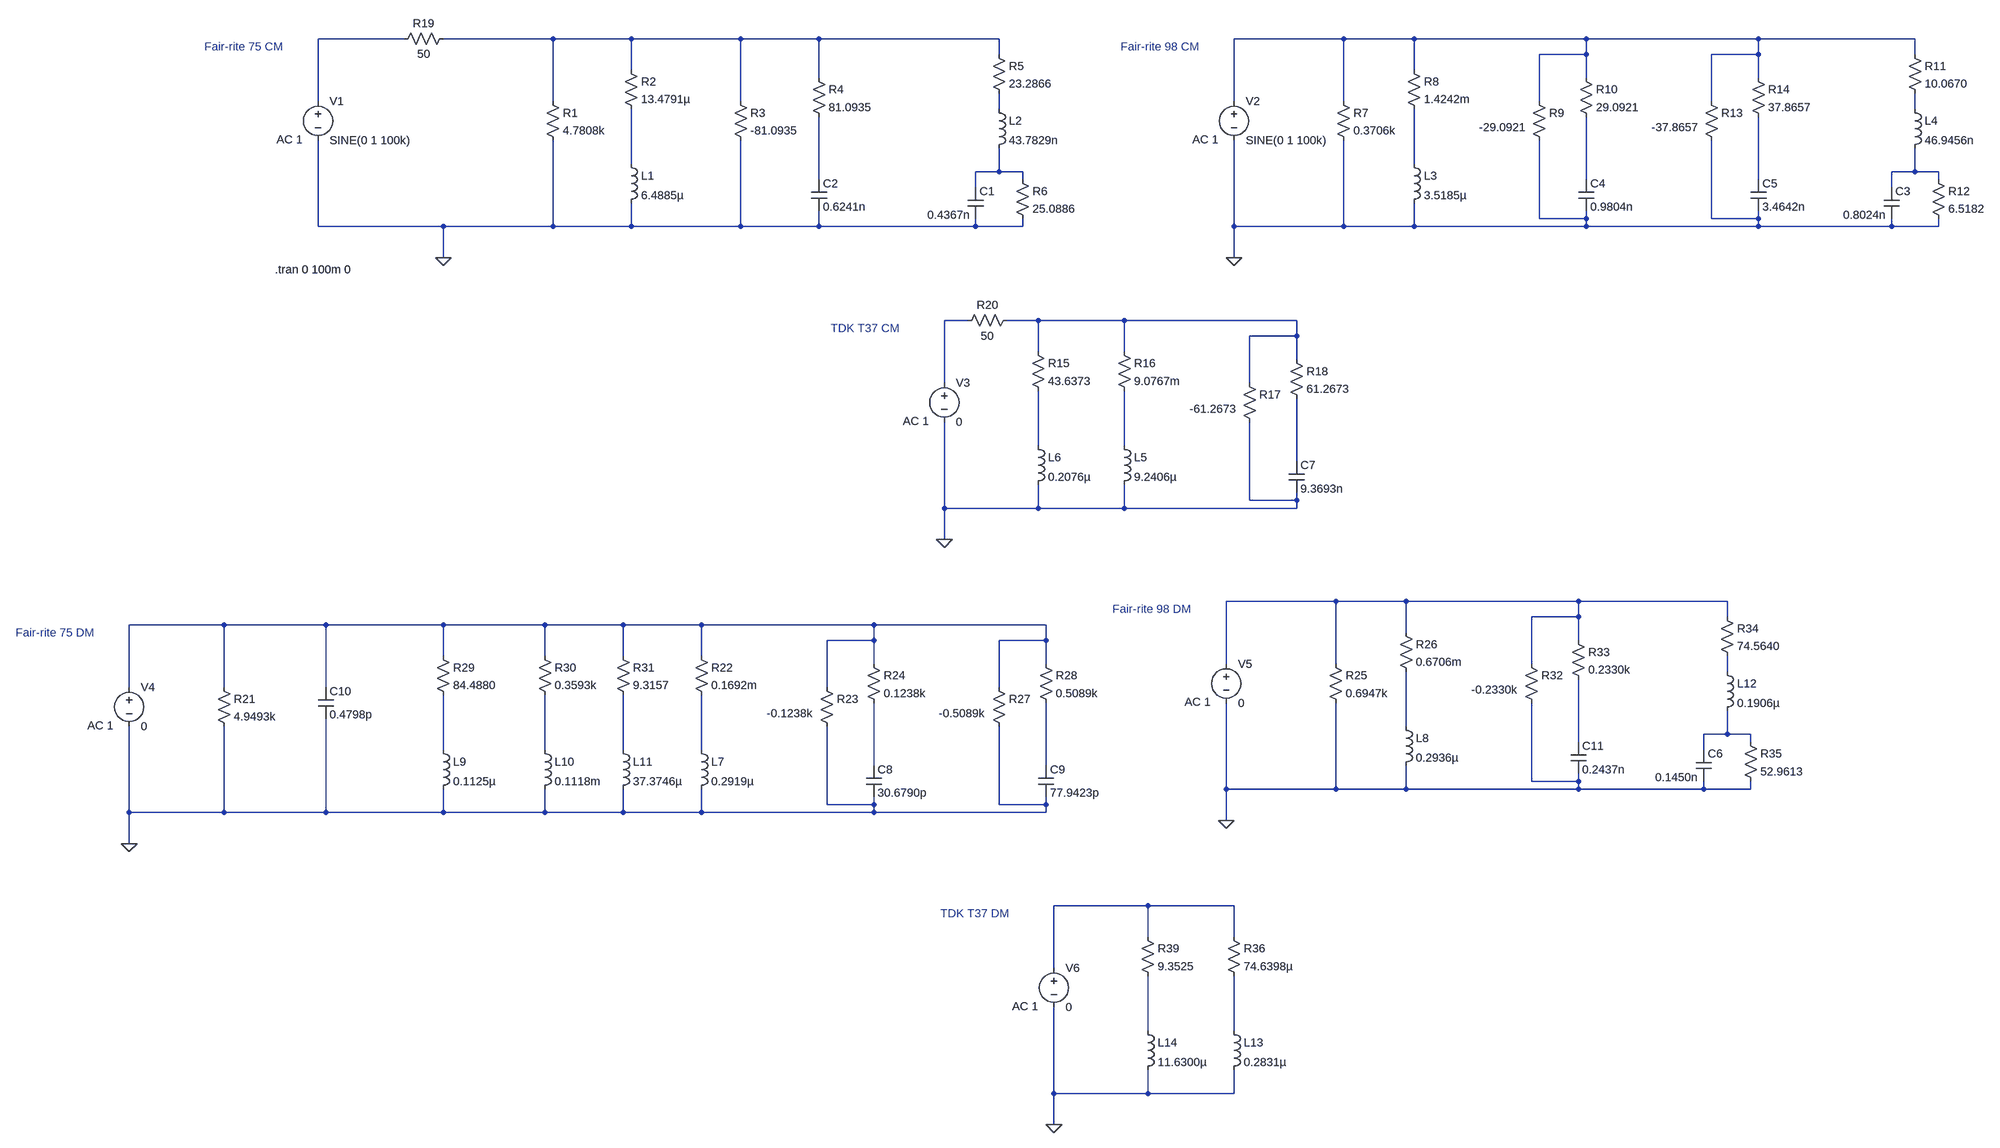
[diagram p0: schematic EC.asc]
EC.asc, the LTspice schematic file:
Version 4
SHEET 1 3976 868
WIRE -1728 -1376 -1904 -1376
WIRE -1424 -1376 -1648 -1376
WIRE -1264 -1376 -1424 -1376
WIRE -1040 -1376 -1264 -1376
WIRE -880 -1376 -1040 -1376
WIRE -512 -1376 -880 -1376
WIRE 192 -1376 -32 -1376
WIRE 336 -1376 192 -1376
WIRE 688 -1376 336 -1376
WIRE 1040 -1376 688 -1376
WIRE 1360 -1376 1040 -1376
WIRE -512 -1344 -512 -1376
WIRE 688 -1344 688 -1376
WIRE 688 -1344 592 -1344
WIRE 1040 -1344 1040 -1376
WIRE 1040 -1344 944 -1344
WIRE 1360 -1344 1360 -1376
WIRE -1264 -1312 -1264 -1376
WIRE 336 -1312 336 -1376
WIRE -880 -1296 -880 -1376
WIRE 688 -1296 688 -1344
WIRE 1040 -1296 1040 -1344
WIRE -1904 -1248 -1904 -1376
WIRE -1424 -1248 -1424 -1376
WIRE -1040 -1248 -1040 -1376
WIRE -32 -1248 -32 -1376
WIRE 192 -1248 192 -1376
WIRE 592 -1248 592 -1344
WIRE 944 -1248 944 -1344
WIRE -512 -1232 -512 -1264
WIRE 1360 -1232 1360 -1264
WIRE -1264 -1120 -1264 -1232
WIRE 336 -1120 336 -1232
WIRE -512 -1104 -512 -1152
WIRE -512 -1104 -560 -1104
WIRE -464 -1104 -512 -1104
WIRE 1360 -1104 1360 -1152
WIRE 1360 -1104 1312 -1104
WIRE 1408 -1104 1360 -1104
WIRE -880 -1088 -880 -1216
WIRE -464 -1088 -464 -1104
WIRE 688 -1088 688 -1216
WIRE 1040 -1088 1040 -1216
WIRE 1408 -1088 1408 -1104
WIRE -560 -1072 -560 -1104
WIRE 1312 -1072 1312 -1104
WIRE 592 -1008 592 -1168
WIRE 688 -1008 688 -1024
WIRE 688 -1008 592 -1008
WIRE 944 -1008 944 -1168
WIRE 1040 -1008 1040 -1024
WIRE 1040 -1008 944 -1008
WIRE -1904 -992 -1904 -1168
WIRE -1648 -992 -1904 -992
WIRE -1424 -992 -1424 -1168
WIRE -1424 -992 -1648 -992
WIRE -1264 -992 -1264 -1040
WIRE -1264 -992 -1424 -992
WIRE -1040 -992 -1040 -1168
WIRE -1040 -992 -1264 -992
WIRE -880 -992 -880 -1024
WIRE -880 -992 -1040 -992
WIRE -560 -992 -560 -1008
WIRE -560 -992 -880 -992
WIRE -464 -992 -464 -1008
WIRE -464 -992 -560 -992
WIRE -32 -992 -32 -1168
WIRE 192 -992 192 -1168
WIRE 192 -992 -32 -992
WIRE 336 -992 336 -1040
WIRE 336 -992 192 -992
WIRE 688 -992 688 -1008
WIRE 688 -992 336 -992
WIRE 1040 -992 1040 -1008
WIRE 1040 -992 688 -992
WIRE 1312 -992 1312 -1008
WIRE 1312 -992 1040 -992
WIRE 1408 -992 1408 -1008
WIRE 1408 -992 1312 -992
WIRE -1648 -928 -1648 -992
WIRE -32 -928 -32 -992
WIRE -576 -800 -624 -800
WIRE -432 -800 -496 -800
WIRE -256 -800 -432 -800
WIRE 96 -800 -256 -800
WIRE 96 -768 96 -800
WIRE 96 -768 0 -768
WIRE -432 -736 -432 -800
WIRE -256 -736 -256 -800
WIRE 96 -720 96 -768
WIRE -624 -672 -624 -800
WIRE 0 -672 0 -768
WIRE -432 -544 -432 -656
WIRE -256 -544 -256 -656
WIRE 96 -512 96 -640
WIRE 0 -432 0 -592
WIRE 96 -432 96 -448
WIRE 96 -432 0 -432
WIRE -624 -416 -624 -592
WIRE -432 -416 -432 -464
WIRE -432 -416 -624 -416
WIRE -256 -416 -256 -464
WIRE -256 -416 -432 -416
WIRE 96 -416 96 -432
WIRE 96 -416 -256 -416
WIRE -624 -352 -624 -416
WIRE 176 -224 -48 -224
WIRE 320 -224 176 -224
WIRE 672 -224 320 -224
WIRE 976 -224 672 -224
WIRE 672 -192 672 -224
WIRE 672 -192 576 -192
WIRE 976 -192 976 -224
WIRE -2096 -176 -2320 -176
WIRE -1888 -176 -2096 -176
WIRE -1648 -176 -1888 -176
WIRE -1440 -176 -1648 -176
WIRE -1280 -176 -1440 -176
WIRE -1120 -176 -1280 -176
WIRE -768 -176 -1120 -176
WIRE -416 -176 -768 -176
WIRE 320 -160 320 -224
WIRE -768 -144 -768 -176
WIRE -768 -144 -864 -144
WIRE -416 -144 -416 -176
WIRE -416 -144 -512 -144
WIRE 672 -144 672 -192
WIRE -1648 -112 -1648 -176
WIRE -1440 -112 -1440 -176
WIRE -1280 -112 -1280 -176
WIRE -1120 -112 -1120 -176
WIRE -768 -96 -768 -144
WIRE -416 -96 -416 -144
WIRE -48 -96 -48 -224
WIRE 176 -96 176 -224
WIRE 576 -96 576 -192
WIRE 976 -80 976 -112
WIRE -2320 -48 -2320 -176
WIRE -2096 -48 -2096 -176
WIRE -1888 -48 -1888 -176
WIRE -864 -48 -864 -144
WIRE -512 -48 -512 -144
WIRE 320 32 320 -80
WIRE 976 48 976 0
WIRE 976 48 928 48
WIRE 1024 48 976 48
WIRE 672 64 672 -64
WIRE 1024 64 1024 48
WIRE -1648 80 -1648 -32
WIRE -1440 80 -1440 -32
WIRE -1280 80 -1280 -32
WIRE -1120 80 -1120 -32
WIRE 928 80 928 48
WIRE -768 112 -768 -16
WIRE -416 112 -416 -16
WIRE 576 144 576 -16
WIRE 672 144 672 128
WIRE 672 144 576 144
WIRE -48 160 -48 -16
WIRE 176 160 176 -16
WIRE 176 160 -48 160
WIRE 320 160 320 112
WIRE 320 160 176 160
WIRE 672 160 672 144
WIRE 672 160 320 160
WIRE 928 160 928 144
WIRE 928 160 672 160
WIRE 1024 160 1024 144
WIRE 1024 160 928 160
WIRE -864 192 -864 32
WIRE -768 192 -768 176
WIRE -768 192 -864 192
WIRE -512 192 -512 32
WIRE -416 192 -416 176
WIRE -416 192 -512 192
WIRE -2320 208 -2320 32
WIRE -2096 208 -2096 32
WIRE -2096 208 -2320 208
WIRE -1888 208 -1888 16
WIRE -1888 208 -2096 208
WIRE -1648 208 -1648 160
WIRE -1648 208 -1888 208
WIRE -1440 208 -1440 160
WIRE -1440 208 -1648 208
WIRE -1280 208 -1280 160
WIRE -1280 208 -1440 208
WIRE -1120 208 -1120 160
WIRE -1120 208 -1280 208
WIRE -768 208 -768 192
WIRE -768 208 -1120 208
WIRE -416 208 -416 192
WIRE -416 208 -768 208
WIRE -48 224 -48 160
WIRE -2320 272 -2320 208
WIRE -208 400 -400 400
WIRE -32 400 -208 400
WIRE -208 464 -208 400
WIRE -32 464 -32 400
WIRE -400 528 -400 400
WIRE -208 656 -208 544
WIRE -32 656 -32 544
WIRE -400 784 -400 608
WIRE -208 784 -208 736
WIRE -208 784 -400 784
WIRE -32 784 -32 736
WIRE -32 784 -208 784
WIRE -400 848 -400 784
FLAG -1648 -928 0
FLAG -32 -928 0
FLAG -624 -352 0
FLAG -2320 272 0
FLAG -48 224 0
FLAG -400 848 0
SYMBOL voltage -1904 -1264 R0
WINDOW 123 -85 94 Left 2
WINDOW 39 0 0 Left 0
SYMATTR Value2 AC 1
SYMATTR InstName V1
SYMATTR Value SINE(0 1 100k)
SYMBOL res -1440 -1264 R0
SYMATTR InstName R1
SYMATTR Value 4.7808k
SYMBOL res -1280 -1328 R0
SYMATTR InstName R2
SYMATTR Value 13.4791µ
SYMBOL res -1056 -1264 R0
SYMATTR InstName R3
SYMATTR Value -81.0935
SYMBOL res -896 -1312 R0
SYMATTR InstName R4
SYMATTR Value 81.0935
SYMBOL res -528 -1360 R0
SYMATTR InstName R5
SYMATTR Value 23.2866
SYMBOL res -480 -1104 R0
SYMATTR InstName R6
SYMATTR Value 25.0886
SYMBOL cap -576 -1072 R0
WINDOW 3 -83 56 Left 2
SYMATTR Value 0.4367n
SYMATTR InstName C1
SYMBOL cap -896 -1088 R0
SYMATTR InstName C2
SYMATTR Value 0.6241n
SYMBOL ind -1280 -1136 R0
SYMATTR InstName L1
SYMATTR Value 6.4885µ
SYMBOL ind -528 -1248 R0
SYMATTR InstName L2
SYMATTR Value 43.7829n
SYMBOL voltage -32 -1264 R0
WINDOW 123 -85 94 Left 2
WINDOW 39 0 0 Left 0
SYMATTR Value2 AC 1
SYMATTR InstName V2
SYMATTR Value SINE(0 1 100k)
SYMBOL res 176 -1264 R0
SYMATTR InstName R7
SYMATTR Value 0.3706k
SYMBOL res 320 -1328 R0
SYMATTR InstName R8
SYMATTR Value 1.4242m
SYMBOL res 576 -1264 R0
WINDOW 3 -107 69 Left 2
SYMATTR Value -29.0921
SYMATTR InstName R9
SYMBOL res 672 -1312 R0
SYMATTR InstName R10
SYMATTR Value 29.0921
SYMBOL res 1344 -1360 R0
SYMATTR InstName R11
SYMATTR Value 10.0670
SYMBOL res 1392 -1104 R0
SYMATTR InstName R12
SYMATTR Value 6.5182
SYMBOL cap 1296 -1072 R0
WINDOW 3 -83 56 Left 2
SYMATTR Value 0.8024n
SYMATTR InstName C3
SYMBOL cap 672 -1088 R0
SYMATTR InstName C4
SYMATTR Value 0.9804n
SYMBOL ind 320 -1136 R0
SYMATTR InstName L3
SYMATTR Value 3.5185µ
SYMBOL ind 1344 -1248 R0
SYMATTR InstName L4
SYMATTR Value 46.9456n
SYMBOL res 928 -1264 R0
WINDOW 3 -107 69 Left 2
SYMATTR Value -37.8657
SYMATTR InstName R13
SYMBOL res 1024 -1312 R0
SYMATTR InstName R14
SYMATTR Value 37.8657
SYMBOL cap 1024 -1088 R0
SYMATTR InstName C5
SYMATTR Value 3.4642n
SYMBOL voltage -624 -688 R0
WINDOW 123 -85 94 Left 2
WINDOW 39 0 0 Left 0
SYMATTR Value2 AC 1
SYMATTR InstName V3
SYMATTR Value 0
SYMBOL res -272 -752 R0
SYMATTR InstName R16
SYMATTR Value 9.0767m
SYMBOL res -16 -688 R0
WINDOW 3 -107 69 Left 2
SYMATTR Value -61.2673
SYMATTR InstName R17
SYMBOL res 80 -736 R0
SYMATTR InstName R18
SYMATTR Value 61.2673
SYMBOL cap 80 -512 R0
SYMATTR InstName C7
SYMATTR Value 9.3693n
SYMBOL ind -272 -560 R0
SYMATTR InstName L5
SYMATTR Value 9.2406µ
SYMBOL res -448 -752 R0
SYMATTR InstName R15
SYMATTR Value 43.6373
SYMBOL ind -448 -560 R0
SYMATTR InstName L6
SYMATTR Value 0.2076µ
SYMBOL res -1632 -1392 R90
WINDOW 0 0 56 VBottom 2
WINDOW 3 32 56 VTop 2
SYMATTR InstName R19
SYMATTR Value 50
SYMBOL res -480 -816 R90
WINDOW 0 0 56 VBottom 2
WINDOW 3 32 56 VTop 2
SYMATTR InstName R20
SYMATTR Value 50
SYMBOL voltage -2320 -64 R0
WINDOW 123 -85 94 Left 2
WINDOW 39 0 0 Left 0
SYMATTR Value2 AC 1
SYMATTR InstName V4
SYMATTR Value 0
SYMBOL res -2112 -64 R0
SYMATTR InstName R21
SYMATTR Value 4.9493k
SYMBOL res -1136 -128 R0
SYMATTR InstName R22
SYMATTR Value 0.1692m
SYMBOL res -880 -64 R0
WINDOW 3 -107 69 Left 2
SYMATTR Value -0.1238k
SYMATTR InstName R23
SYMBOL res -784 -112 R0
SYMATTR InstName R24
SYMATTR Value 0.1238k
SYMBOL cap -784 112 R0
SYMATTR InstName C8
SYMATTR Value 30.6790p
SYMBOL ind -1136 64 R0
SYMATTR InstName L7
SYMATTR Value 0.2919µ
SYMBOL res -528 -64 R0
WINDOW 3 -107 69 Left 2
SYMATTR Value -0.5089k
SYMATTR InstName R27
SYMBOL res -432 -112 R0
SYMATTR InstName R28
SYMATTR Value 0.5089k
SYMBOL cap -432 112 R0
SYMATTR InstName C9
SYMATTR Value 77.9423p
SYMBOL cap -1904 -48 R0
SYMATTR InstName C10
SYMATTR Value 0.4798p
SYMBOL res -1664 -128 R0
SYMATTR InstName R29
SYMATTR Value 84.4880
SYMBOL ind -1664 64 R0
SYMATTR InstName L9
SYMATTR Value 0.1125µ
SYMBOL res -1456 -128 R0
SYMATTR InstName R30
SYMATTR Value 0.3593k
SYMBOL ind -1456 64 R0
SYMATTR InstName L10
SYMATTR Value 0.1118m
SYMBOL res -1296 -128 R0
SYMATTR InstName R31
SYMATTR Value 9.3157
SYMBOL ind -1296 64 R0
SYMATTR InstName L11
SYMATTR Value 37.3746µ
SYMBOL voltage -48 -112 R0
WINDOW 123 -85 94 Left 2
WINDOW 39 0 0 Left 0
SYMATTR Value2 AC 1
SYMATTR InstName V5
SYMATTR Value 0
SYMBOL res 160 -112 R0
SYMATTR InstName R25
SYMATTR Value 0.6947k
SYMBOL res 304 -176 R0
SYMATTR InstName R26
SYMATTR Value 0.6706m
SYMBOL res 560 -112 R0
WINDOW 3 -107 69 Left 2
SYMATTR Value -0.2330k
SYMATTR InstName R32
SYMBOL res 656 -160 R0
SYMATTR InstName R33
SYMATTR Value 0.2330k
SYMBOL res 960 -208 R0
SYMATTR InstName R34
SYMATTR Value 74.5640
SYMBOL res 1008 48 R0
SYMATTR InstName R35
SYMATTR Value 52.9613
SYMBOL cap 912 80 R0
WINDOW 3 -83 56 Left 2
SYMATTR Value 0.1450n
SYMATTR InstName C6
SYMBOL cap 656 64 R0
SYMATTR InstName C11
SYMATTR Value 0.2437n
SYMBOL ind 304 16 R0
SYMATTR InstName L8
SYMATTR Value 0.2936µ
SYMBOL ind 960 -96 R0
SYMATTR InstName L12
SYMATTR Value 0.1906µ
SYMBOL voltage -400 512 R0
WINDOW 123 -85 94 Left 2
WINDOW 39 0 0 Left 0
SYMATTR Value2 AC 1
SYMATTR InstName V6
SYMATTR Value 0
SYMBOL res -48 448 R0
SYMATTR InstName R36
SYMATTR Value 74.6398µ
SYMBOL ind -48 640 R0
SYMATTR InstName L13
SYMATTR Value 0.2831µ
SYMBOL res -224 448 R0
SYMATTR InstName R39
SYMATTR Value 9.3525
SYMBOL ind -224 640 R0
SYMATTR InstName L14
SYMATTR Value 11.6300µ
TEXT -1992 -904 Left 2 !.tran 0 100m 0
TEXT -2136 -1360 Left 2 ;Fair-rite 75 CM
TEXT -264 -1360 Left 2 ;Fair-rite 98 CM
TEXT -856 -784 Left 2 ;TDK T37 CM
TEXT -2552 -160 Left 2 ;Fair-rite 75 DM
TEXT -280 -208 Left 2 ;Fair-rite 98 DM
TEXT -632 416 Left 2 ;TDK T37 DM

The netlist it stands for:
* EC.asc
V1 N001 0 SINE(0 1 100k) AC 1
R1 N002 0 4.7808k
R2 N002 N006 13.4791µ
R3 N002 0 -81.0935
R4 N002 N010 81.0935
R5 N002 N004 23.2866
R6 N008 0 25.0886
C1 N008 0 0.4367n
C2 N010 0 0.6241n
L1 N006 0 6.4885µ
L2 N004 N008 43.7829n
V2 N003 0 SINE(0 1 100k) AC 1
R7 N003 0 0.3706k
R8 N003 N007 1.4242m
R9 N003 0 -29.0921
R10 N003 N011 29.0921
R11 N003 N005 10.0670
R12 N009 0 6.5182
C3 N009 0 0.8024n
C4 N011 0 0.9804n
L3 N007 0 3.5185µ
L4 N005 N009 46.9456n
R13 N003 0 -37.8657
R14 N003 N012 37.8657
C5 N012 0 3.4642n
V3 N013 0 0 AC 1
R16 N014 N016 9.0767m
R17 N014 0 -61.2673
R18 N014 N017 61.2673
C7 N017 0 9.3693n
L5 N016 0 9.2406µ
R15 N014 N015 43.6373
L6 N015 0 0.2076µ
R19 N002 N001 50
R20 N014 N013 50
V4 N019 0 0 AC 1
R21 N019 0 4.9493k
R22 N019 N027 0.1692m
R23 N019 0 -0.1238k
R24 N019 N028 0.1238k
C8 N028 0 30.6790p
L7 N027 0 0.2919µ
R27 N019 0 -0.5089k
R28 N019 N029 0.5089k
C9 N029 0 77.9423p
C10 N019 0 0.4798p
R29 N019 N024 84.4880
L9 N024 0 0.1125µ
R30 N019 N025 0.3593k
L10 N025 0 0.1118m
R31 N019 N026 9.3157
L11 N026 0 37.3746µ
V5 N018 0 0 AC 1
R25 N018 0 0.6947k
R26 N018 N021 0.6706m
R32 N018 0 -0.2330k
R33 N018 N023 0.2330k
R34 N018 N020 74.5640
R35 N022 0 52.9613
C6 N022 0 0.1450n
C11 N023 0 0.2437n
L8 N021 0 0.2936µ
L12 N020 N022 0.1906µ
V6 N030 0 0 AC 1
R36 N030 N032 74.6398µ
L13 N032 0 0.2831µ
R39 N030 N031 9.3525
L14 N031 0 11.6300µ
.tran 0 100m 0
* Fair-rite 75 CM
* Fair-rite 98 CM
* TDK T37 CM
* Fair-rite 75 DM
* Fair-rite 98 DM
* TDK T37 DM
.backanno
.end